# Altium project PCB_Project.PrjPcb
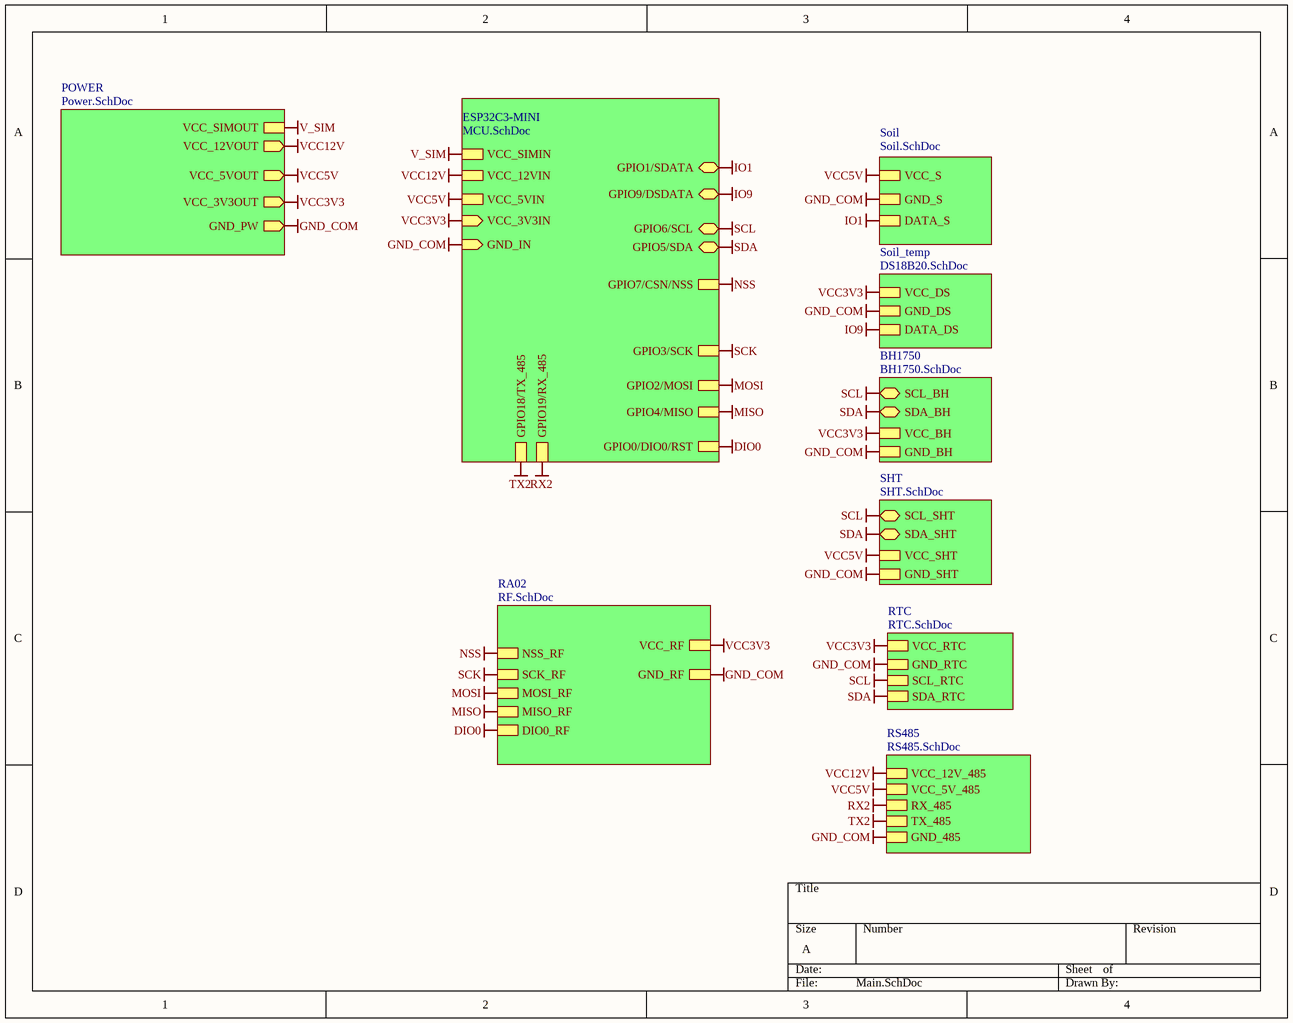
[diagram p0: Main.SchDoc]
7 sheets, 55 parts. Net scope: hierarchical (ports join the sheet entries above them; power ports are global).
Board file: Node_ver2.PcbDoc
Sheets:
  Main.SchDoc
    ESP32C3-MINI = MCU.SchDoc
    POWER = Power.SchDoc
    RTC = RTC.SchDoc
    Soil = Soil.SchDoc
    Soil_temp = DS18B20.SchDoc
    RA02 = RF.SchDoc

## Sheet Main.SchDoc
size A

### Sub-sheets
BH1750 = BH1750.SchDoc (file not in this document): SCL_BH (bidir), SDA_BH (bidir), VCC_BH, GND_BH
ESP32C3-MINI = MCU.SchDoc: VCC_3V3IN (in), GND_IN (in), GPIO1/SDATA (bidir), GPIO9/DSDATA (bidir), GPIO6/SCL (bidir), GPIO5/SDA (bidir), VCC_5VIN, VCC_12VIN, GPIO18/TX_485, GPIO19/RX_485, VCC_SIMIN, GPIO0/DIO0/RST, GPIO2/MOSI, GPIO3/SCK, GPIO7/CSN/NSS, GPIO4/MISO
POWER = Power.SchDoc: VCC_12VOUT (out), VCC_5VOUT (out), VCC_3V3OUT (out), GND_PW (out), VCC_SIMOUT
RA02 = RF.SchDoc: NSS_RF, SCK_RF, MOSI_RF, MISO_RF, DIO0_RF, VCC_RF, GND_RF
RS485 = RS485.SchDoc (file not in this document): VCC_12V_485, VCC_5V_485, RX_485, TX_485, GND_485
RTC = RTC.SchDoc: VCC_RTC, GND_RTC, SCL_RTC, SDA_RTC
SHT = SHT.SchDoc (file not in this document): SCL_SHT (bidir), SDA_SHT (bidir), VCC_SHT, GND_SHT
Soil = Soil.SchDoc: VCC_S, GND_S, DATA_S
Soil_temp = DS18B20.SchDoc: VCC_DS, GND_DS, DATA_DS

### Nets
DIO0: sheet ESP32C3-MINI/GPIO0/DIO0/RST, sheet RA02/DIO0_RF  [project net GPIO0]
GND_COM: sheet ESP32C3-MINI/GND_IN, sheet POWER/GND_PW, sheet RTC/GND_RTC, sheet Soil/GND_S, sheet Soil_temp/GND_DS, sheet BH1750/GND_BH, sheet SHT/GND_SHT, sheet RS485/GND_485, sheet RA02/GND_RF  [project net GND]
IO1: sheet ESP32C3-MINI/GPIO1/SDATA, sheet Soil/DATA_S  [project net GPIO1]
IO9: sheet ESP32C3-MINI/GPIO9/DSDATA, sheet Soil_temp/DATA_DS  [project net GPIO10]
MISO: sheet ESP32C3-MINI/GPIO4/MISO, sheet RA02/MISO_RF  [project net GPIO4]
MOSI: sheet ESP32C3-MINI/GPIO19/RX_485, sheet ESP32C3-MINI/GPIO2/MOSI, sheet RS485/RX_485, sheet RA02/MOSI_RF  [also labelled RX2]  [project net GPIO18]
NSS: sheet ESP32C3-MINI/GPIO7/CSN/NSS, sheet RA02/NSS_RF  [project net GPIO7]
SCK: sheet ESP32C3-MINI/GPIO3/SCK, sheet RA02/SCK_RF  [project net GPIO3]
SCL: sheet ESP32C3-MINI/GPIO6/SCL, sheet RTC/SCL_RTC, sheet BH1750/SCL_BH, sheet SHT/SCL_SHT  [project net GPIO6]
SDA: sheet ESP32C3-MINI/GPIO5/SDA, sheet RTC/SDA_RTC, sheet BH1750/SDA_BH, sheet SHT/SDA_SHT  [project net GPIO5]
TX2: sheet ESP32C3-MINI/GPIO18/TX_485, sheet RS485/TX_485  [project net GPIO19]
V_SIM: sheet ESP32C3-MINI/VCC_SIMIN, sheet POWER/VCC_SIMOUT  [project net V_SIM_7V]
VCC3V3: sheet ESP32C3-MINI/VCC_3V3IN, sheet POWER/VCC_3V3OUT, sheet RTC/VCC_RTC, sheet Soil_temp/VCC_DS, sheet BH1750/VCC_BH, sheet RA02/VCC_RF  [project net VCC_3V3MCU]
VCC5V: sheet ESP32C3-MINI/VCC_5VIN, sheet POWER/VCC_5VOUT, sheet Soil/VCC_S, sheet SHT/VCC_SHT, sheet RS485/VCC_5V_485  [project net VCC_5VPW]
VCC12V: sheet ESP32C3-MINI/VCC_12VIN, sheet POWER/VCC_12VOUT, sheet RS485/VCC_12V_485  [project net BAT_11V6]

## Sheet MCU.SchDoc
size A
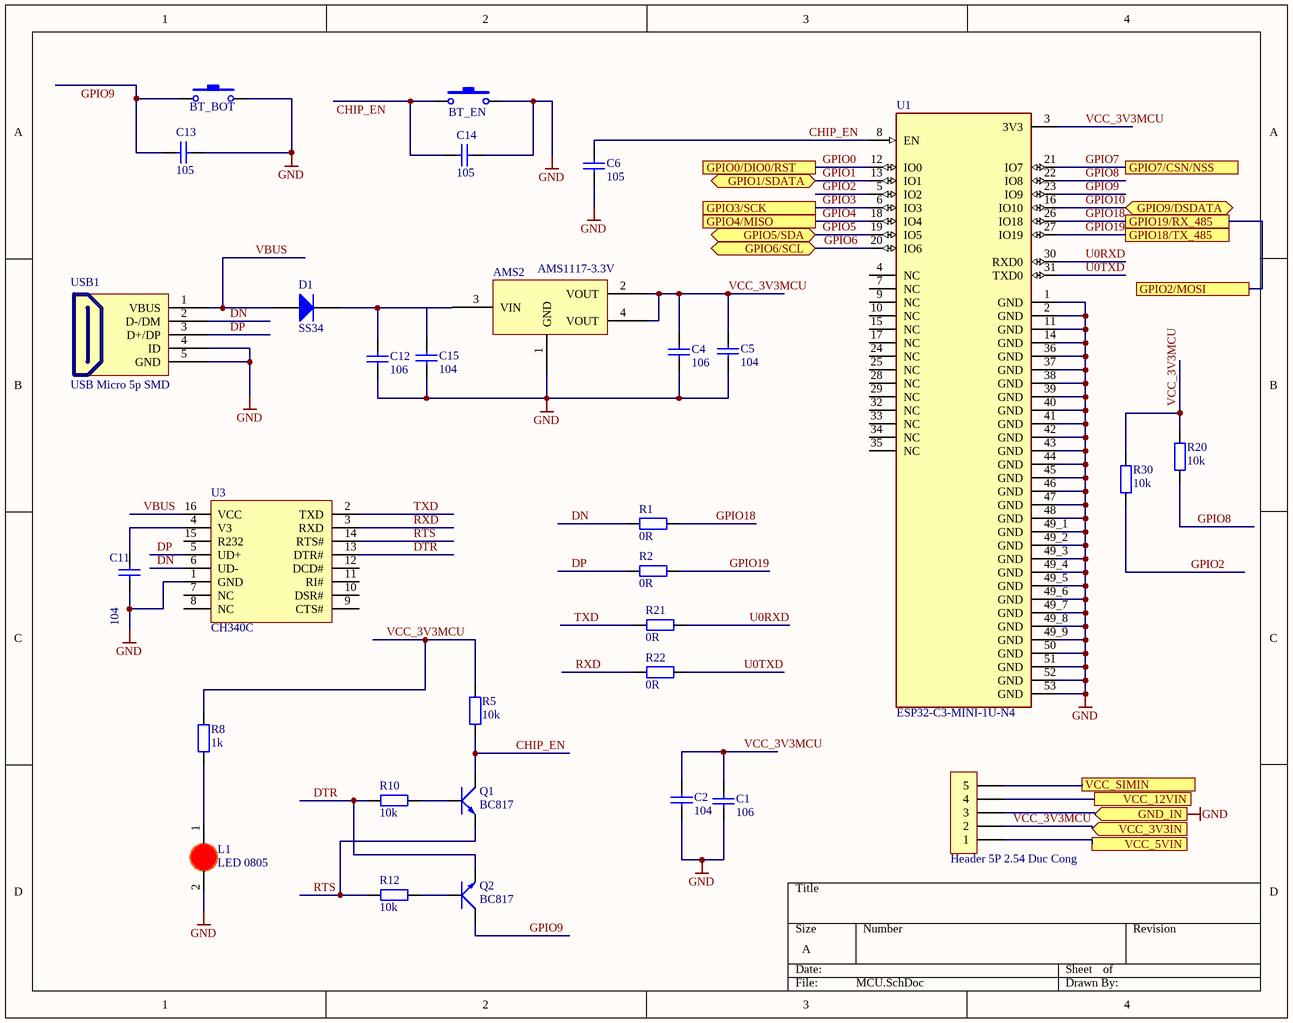
[diagram p1: MCU.SchDoc]

### Parts
AMS2  AMS1117-3.3V  [SOT223]
BT_BOT  Nut Nhan 2 Chan SMD 3x6x2.5  [Nut Nhan 2 Chan SMD 3x6x2.5]  (value not drawn)
BT_EN  Nut Nhan 2 Chan SMD 3x6x2.5  [Nut Nhan 2 Chan SMD 3x6x2.5]  (value not drawn)
C1  106  [tu 0805]
C2  104  [tu 0805]
C4  106  [tu 0805]
C5  104  [tu 0805]
C6  105  [tu 0805]
C11  104  [tu 0805]
C12  106  [tu 0805]
C13  105  [tu 0805]
C14  105  [tu 0805]
C15  104  [tu 0805]
D1  SS34  [DIODE SMA]
L1  LED 0805  [LED-0805-Red]
P_IN  Header 5P 2.54 Duc Cong  [Header 5P DC 2.54]
Q1  BC817  [SOT-23]
Q2  BC817  [SOT-23]
R1  0R  [tro smd 0805]
R2  0R  [tro smd 0805]
R5  10k  [tro smd 0805]
R8  1k  [tro smd 0805]
R10  10k  [tro smd 0805]
R12  10k  [tro smd 0805]
R20  10k  [tro smd 0805]
R21  0R  [tro smd 0805]
R22  0R  [tro smd 0805]
R30  10k  [tro smd 0805]
U1  ESP32-C3-MINI-1U-N4  [XCVR_ESP32-C3-MINI-1U-N4]
U3  CH340C  [SOIC16_50_284_25X90_SMT]
USB1  USB Micro 5p SMD  [USB Micro 5p SMD]

### Ports
GND_IN (in), GPIO0/DIO0/RST, GPIO1/SDATA (bidir), GPIO2/MOSI, GPIO3/SCK, GPIO4/MISO, GPIO5/SDA (bidir), GPIO6/SCL (bidir), GPIO7/CSN/NSS, GPIO9/DSDATA (bidir), GPIO18/TX_485, GPIO19/RX_485, VCC_3V3IN (in), VCC_5VIN, VCC_12VIN, VCC_SIMIN

### Nets
BAT_11V6: P_IN.4 ; port VCC_12VIN
GND: AMS2.1(GND) BT_BOT.2 BT_EN.2 C1.2 C2.2 C4.2 C5.2 C6.2 C11.2 C12.2 C13.1 C14.1 C15.2 L1.2(K) P_IN.3 U1.1(GND) U1.2(GND) U1.11(GND) U1.14(GND) U1.36(GND) U1.37(GND) U1.38(GND) U1.39(GND) U1.40(GND) U1.41(GND) U1.42(GND) U1.43(GND) U1.44(GND) U1.45(GND) U1.46(GND) U1.47(GND) U1.48(GND) U1.49_1(GND) U1.49_2(GND) U1.49_3(GND) U1.49_4(GND) U1.49_5(GND) U1.49_6(GND) U1.49_7(GND) U1.49_8(GND) U1.49_9(GND) U1.50(GND) U1.51(GND) U1.52(GND) U1.53(GND) U3.1(GND) USB1.4(ID) USB1.5(GND) ; port GND_IN
GPIO0: U1.12(IO0) ; port GPIO0/DIO0/RST
GPIO1: U1.13(IO1) ; port GPIO1/SDATA
GPIO3: U1.6(IO3) ; port GPIO3/SCK
GPIO4: U1.18(IO4) ; port GPIO4/MISO
GPIO5: U1.19(IO5) ; port GPIO5/SDA
GPIO6: U1.20(IO6) ; port GPIO6/SCL
GPIO7: U1.21(IO7) ; port GPIO7/CSN/NSS
GPIO10: U1.16(IO10) ; port GPIO9/DSDATA
GPIO18: R1.2 U1.26(IO18) ; port GPIO2/MOSI, port GPIO19/RX_485
GPIO19: R2.2 U1.27(IO19) ; port GPIO18/TX_485
V_SIM_7V: P_IN.5 ; port VCC_SIMIN
VCC_3V3MCU: AMS2.2(VOUT) AMS2.4(VOUT) C1.1 C2.1 C4.1 C5.1 P_IN.2 R5.2 R8.2 R20.2 R30.2 U1.3(3V3) ; port VCC_3V3IN
VCC_5VPW: P_IN.1 ; port VCC_5VIN
CHIP_EN: BT_EN.1 C6.1 C14.2 Q1.3(C) R5.1 U1.8(EN)
DN: R1.1 U3.6(UD-) USB1.2(D-/DM)
DP: R2.1 U3.5(UD+) USB1.3(D+/DP)
DTR: Q2.2(E) R10.1 U3.13(DTR#)
GPIO2: R30.1 U1.5(IO2)
GPIO8: R20.1 U1.22(IO8)
GPIO9: BT_BOT.1 C13.2 Q2.3(C) U1.23(IO9)
RTS: Q1.2(E) R12.1 U3.14(RTS#)
RXD: R22.1 U3.3(RXD)
TXD: R21.1 U3.2(TXD)
U0RXD: R21.2 U1.30(RXD0)
U0TXD: R22.2 U1.31(TXD0)
VBUS: D1.1(A) U3.16(VCC) USB1.1(VBUS)
NetAMS2_3: AMS2.3(VIN) C12.1 D1.2(K)
NetC11_1: C11.1 U3.4(V3)
NetL1_1: L1.1(A) R8.1
NetQ1_1: Q1.1(B) R10.2
NetQ2_1: Q2.1(B) R12.2

Not connected (* = marked no-connect by the designer): C15 1; U1 4(NC) 7(NC) 9(NC) 10(NC) 15(NC) 17(NC) 24(NC) 25(NC) 28(NC) 29(NC) 32(NC) 33(NC) 34(NC) 35(NC); U3 7(NC) 8(NC) 9(CTS#) 10(DSR#) 11(RI#) 12(DCD#) 15(R232)

### Library data of the parts
AMS2 = AMS1117 SMD: Dán; Value: AMS1117-3.3V SOT223; Don_Vi: Con; Ma_Hang: MH000596; Ghi_Chu: *; Kieu_Chan: *; Chung_Loai: Dán
BT_BOT BT_EN = Nut Nhan 2 Chan SMD 3x6x2.5: Ten: Nút Nhấn 2 Chân 3x6x2.5MM SMD; Ma_Hang: MH001036
C1 = Tu 0805 106 16V 10%: Dán; Don_Vi: Con; So_Chan: 2; Ten_Linh_Kien: Tụ 0805 106-10uF 10% 16V; Ma_Hang: MH004553; Chung_Loai: Dán; Kieu_Chan: *
C2 C5 C11 C15 = Tu 0805 104 50V 10%: Dán; Don_Vi: Con; So_Chan: 2; Ten_Linh_Kien: Tụ 0805 104-100nF 10% 50V; Ma_Hang: MH004551; Chung_Loai: Dán; Kieu_Chan: *
C4 C12 = Tu 0805 106 16V 10%: Dán; Ten_Linh_Kien: Tụ 0805 106-10uF 10% 16V; So_Chan: 2; Don_Vi: Con; Ma_Hang: MH004553; Chung_Loai: Dán; Kieu_Chan: *
C6 C13 C14 = Tu 0805 105 50V 10%: Dán; Don_Vi: Con; So_Chan: 2; Ten_Linh_Kien: Tụ 0805 105-1uF 10% 50V; Ma_Hang: MH004552; Chung_Loai: Dán; Kieu_Chan: *
D1 = Diode SS34 ( 1N5822 ): Dán; Don_Vi: Con; Ma_Hang: MH002104; Ten_Linh_Kien: Diode SS34 3A 40V SMA ( 1N5822 SS34A); Kieu_Chan: *; Chung_Loai: Dán
L1 = LED 0805 Do: Dán; Don_Vi: Con; Ma_Hang: MH000897; Ten_Linh_Kien: LED 0805 Màu Đỏ (Red); Ghi_Chu: *; Kieu_Chan: *; Chung_Loai: Dán
P_IN = Header 5P 2.54 Duc Cong: Cắm; Ten_Linh_Kien: Header 5P XH2.54-5P Đực Cong; Don_Vi: Con; Ma_Hang: MH001308; Chung_Loai: Cắm
Q1 Q2 = Trans BC817: SOT-23 - C8658; Value: C9014
R1 R2 R21 R22 = Tro 0805 5% 0R: Dán; Don_Vi: Con; So_Chan: 2; Ten_Linh_Kien: Trở 0805 5% 0R; Ma_Hang: MH005230; Chung_Loai: Dán; Kieu_Chan: *
R5 R10 R12 R20 R30 = Tro 0805 1% 10k: Dán; Don_Vi: Con; So_Chan: 2; Ten_Linh_Kien: Trở 0805 1% 10k; Ma_Hang: MH005473; Chung_Loai: Dán; Kieu_Chan: *
R8 = Tro 0805 1% 1k: Dán; Don_Vi: Con; So_Chan: 2; Ten_Linh_Kien: Trở 0805 1% 1k; Ma_Hang: MH005468; Chung_Loai: Dán; Kieu_Chan: *
U1 = ESP32-C3-MINI-1U-N4: Bluetooth, WiFi 802.11b/g/n, Bluetooth v5.0 Transceiver Module 2.412GHz ~ 2.484GHz Antenna Not Included, I-PEX Surface Mount; MF: Espressif Systems; Value: *; SnapEDA_Link: https://www.snapeda.com/parts/ESP32-C3-MINI-1U-N4/Espressif+Systems/view-part/?ref=snap; MP: ESP32-C3-MINI-1U-N4; Purchase-URL: https://pricing.snapeda.com/search/part/ESP32-C3-MINI-1U-N4/?ref=eda; Check_prices: https://www.snapeda.com/parts/ESP32-C3-MINI-1U-N4/Espressif+Systems/view-part/?ref=eda; Availability: In Stock; Price: None; Package: None
U3 = IC_CH340C: USB Bridge, USB to UART USB 2.0 UART Interface; Manufacturer: Olimex; Alternate Part Number-1: NA; Manufacturer Part Number: CH340C; Case/Package: SOIC16; Supplier-1: LCSC; Supplier Part Number-1: C84681
USB1 = USB Micro 5p SMD: USB Type B; Ten: MicroUSB MK5P SMD; Ma_Hang: MH001020

## Sheet Power.SchDoc
size A
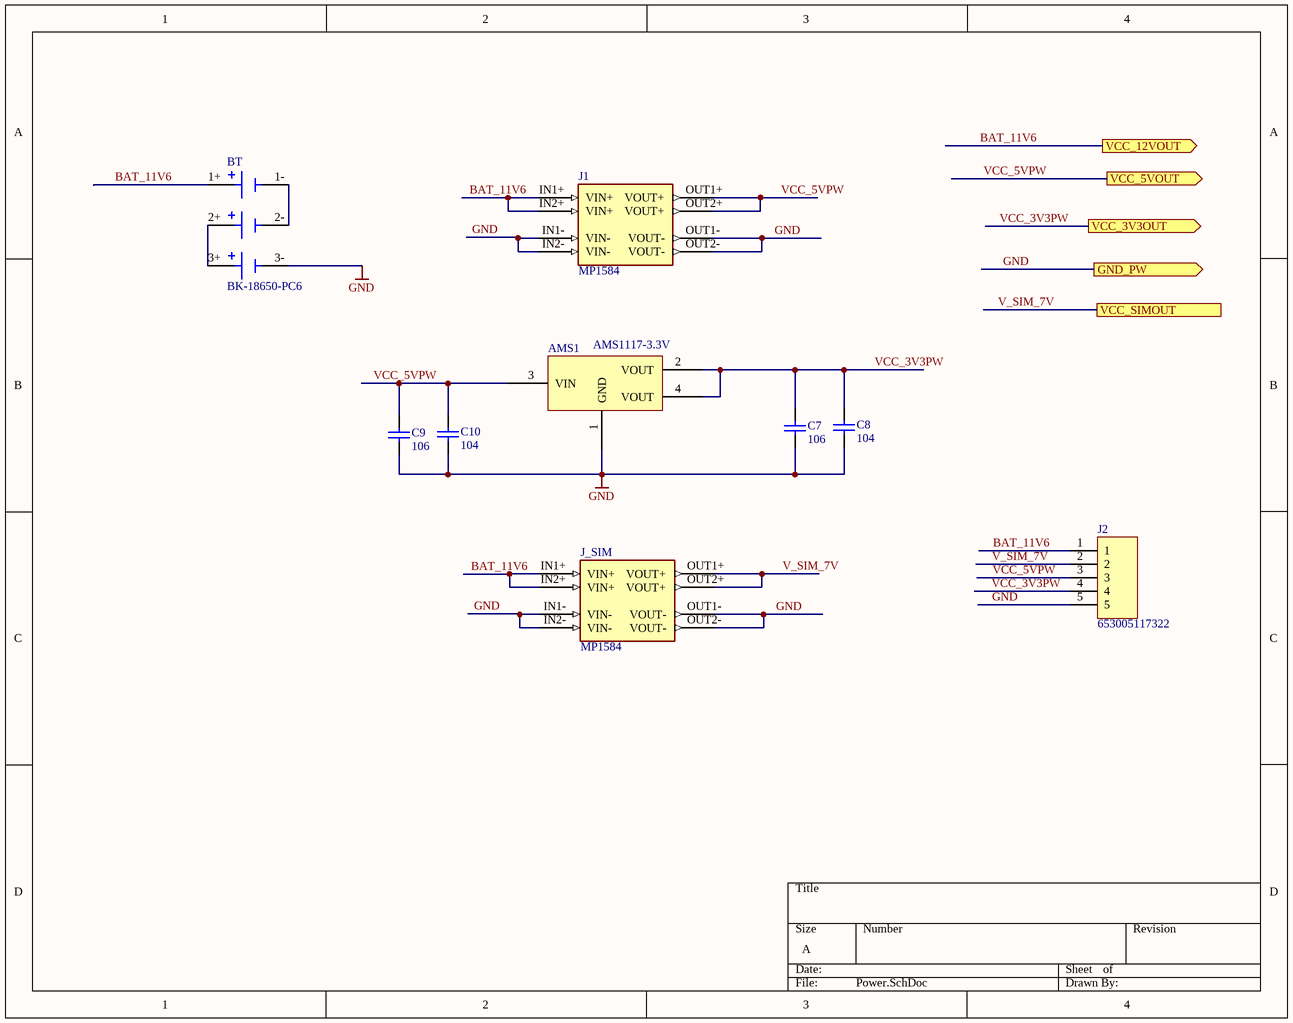
[diagram p2: Power.SchDoc]

### Parts
AMS1  AMS1117-3.3V  [SOT223]
BT  BK-18650-PC6  [BAT_BK-18650-PC6]
C7  106  [tu 0805]
C8  104  [tu 0805]
C9  106  [tu 0805]
C10  104  [tu 0805]
J1  MP1584  [DC-BRICK]
J2  653005117322  [CON5_50_653005117322_TH_RA]
J_SIM  MP1584  [DC-BRICK]

### Ports
GND_PW (out), VCC_3V3OUT (out), VCC_5VOUT (out), VCC_12VOUT (out), VCC_SIMOUT

### Nets
BAT_11V6: BT.1+ J1.IN1+(VIN+) J1.IN2+(VIN+) J2.1 J_SIM.IN1+(VIN+) J_SIM.IN2+(VIN+) ; port VCC_12VOUT
GND: AMS1.1(GND) BT.3- C7.2 C8.2 C9.2 C10.2 J1.IN1-(VIN-) J1.IN2-(VIN-) J1.OUT1-(VOUT-) J1.OUT2-(VOUT-) J2.5 J_SIM.IN1-(VIN-) J_SIM.IN2-(VIN-) J_SIM.OUT1-(VOUT-) J_SIM.OUT2-(VOUT-) ; port GND_PW
V_SIM_7V: J2.2 J_SIM.OUT1+(VOUT+) J_SIM.OUT2+(VOUT+) ; port VCC_SIMOUT
VCC_3V3PW: AMS1.2(VOUT) AMS1.4(VOUT) C7.1 C8.1 J2.4 ; port VCC_3V3OUT  [project net VCC_3V3MCU]
VCC_5VPW: AMS1.3(VIN) C9.1 C10.1 J1.OUT1+(VOUT+) J1.OUT2+(VOUT+) J2.3 ; port VCC_5VOUT
NetBT_1-: BT.1- BT.2-
NetBT_2+: BT.2+ BT.3+

### Library data of the parts
AMS1 = AMS1117 SMD: as AMS2 on sheet MCU; Ghi_Chu: *; Kieu_Chan: *; Chung_Loai: Dán
BT = BK-18650-PC6: Battery Holder _Open_ 18650 3 Cell PC Pin; MF: MPD; Price: None; Package: None; Availability: Unavailable; SnapEDA_Link: https://www.snapeda.com/parts/BK-18650-PC6/MPD/view-part/4480464/?ref=snap; Value: *; MP: BK-18650-PC6
C7 C9 = Tu 0805 106 16V 10%: as C4 on sheet MCU; Chung_Loai: Dán; Kieu_Chan: *
C8 C10 = Tu 0805 104 50V 10%: as C2 on sheet MCU; Chung_Loai: Dán; Kieu_Chan: *
J1 J_SIM = MP1584: Buck Switching Regulator IC Positive Adjustable 0.8V 1 Output 3A 8-SOIC (0.154, 3.90mm Width) Exposed Pad; MF: Monolithic Power; SnapEDA_Link: https://www.snapeda.com/parts/MP1584/Monolithic+Power+Systems+Inc./view-part/?ref=snap; Package: SOIC-8 Monolithic Power; Value: *; MP: MP1584; Check_prices: https://www.snapeda.com/parts/MP1584/Monolithic+Power+Systems+Inc./view-part/?ref=eda
J2 = CON-PLG_5X1-50-RA-TH: 5 Pins, 1 Row 1.25mm Pitch, right angle Connector, male; Manufacturer: JST; Mating Part Number: 653005113322; Crimp Part Number: 653153128130; Alternate Part Number-1: NA; Manufacturer Part Number: 653005117322; Case/Package: TH-CON; Supplier-1: WURTH; Supplier Part Number-1: 653005117322

## Sheet RTC.SchDoc
size A
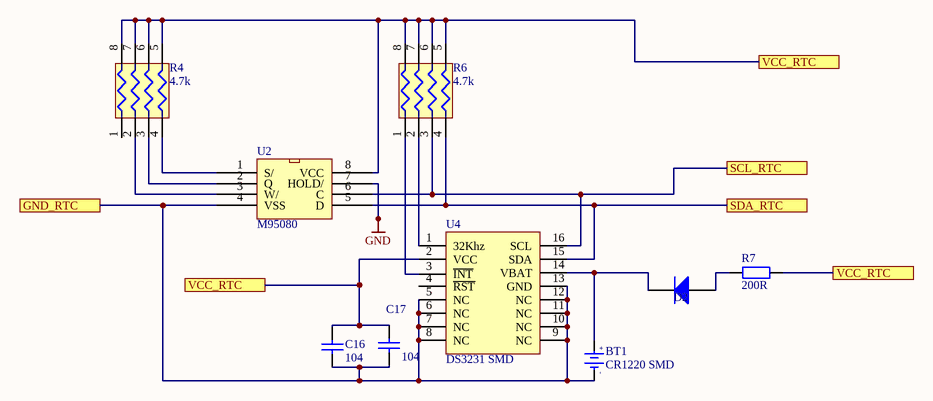
[diagram p3: RTC.SchDoc]

### Parts
BT1  CR1220 SMD  [DE PIN CR1220]
C16  104  [tu 0805]
C17  104  [tu 0805]
D2  SS34  [DIODE SMA]  (value not drawn)
R4  4.7k  [tro bang 0603 4]
R6  4.7k  [tro bang 0603 4]
R7  200R  [tro smd 0805]
U2  M95080  [SOP8_L]
U4  DS3231 SMD  [SOIC 16]

### Ports
GND_RTC, SCL_RTC, SDA_RTC, VCC_RTC

### Nets
GND: BT1.2(GND) C16.2 C17.2 U2.4(VSS) U2.7(HOLD/) U4.5(NC) U4.6(NC) U4.7(NC) U4.8(NC) U4.9(NC) U4.10(NC) U4.11(NC) U4.12(NC) U4.13(GND) ; port GND_RTC
GPIO5: R6.4 U2.5(D) U4.15(SDA) ; port SDA_RTC
GPIO6: R6.3 U2.6(C) U4.16(SCL) ; port SCL_RTC
VCC_3V3MCU: C16.1 C17.1 R4.5 R4.6 R4.7 R4.8 R6.5 R6.6 R6.7 R6.8 R7.2 U2.8(VCC) U4.2(VCC) ; port VCC_RTC
NetBT1_1: BT1.1(+3V) D2.2(K) U4.14(VBAT)
NetD2_1: D2.1(A) R7.1
NetR4_2: R4.2 U2.3(W/)
NetR4_3: R4.3 U2.2(Q)
NetR4_4: R4.4 U2.1(S/)
NetR6_1: R6.1 U4.3(~{INT})
NetR6_2: R6.2 U4.1(32Khz)

Not connected (* = marked no-connect by the designer): R4 1; U4 4(~{RST})

### Notes on the sheet
- (in symbol De pin CR1220 SMD) +; -

### Library data of the parts
BT1 = De pin CR1220 SMD: Ten: Đế PIN CR1220 SMD; Ma_Hang: MH000833
C16 C17 = Tu 0805 104 50V 10%: as C2 on sheet MCU; Chung_Loai: Dán; Kieu_Chan: *
D2 = Diode SS34 ( 1N5822 ): as D1 on sheet MCU; Kieu_Chan: *; Chung_Loai: Dán
R4 R6 = Tro bang 0603 4.7k: Dán; Don_Vi: Con; So_Chan: 8; Ten_Linh_Kien: Trở băng 0603x4 4.7k; Ma_Hang: MH001448; Chung_Loai: Dán; Kieu_Chan: *
R7 = Tro 0805 5% 220R: Dán; Don_Vi: Con; So_Chan: 2; Ten_Linh_Kien: Trở 0805 5% 220R; Ma_Hang: MH005259; Chung_Loai: Dán; Kieu_Chan: *
U2 = EEPROM_M95080
U4 = DS3231 SMD: SOIC

## Sheet Soil.SchDoc
size A
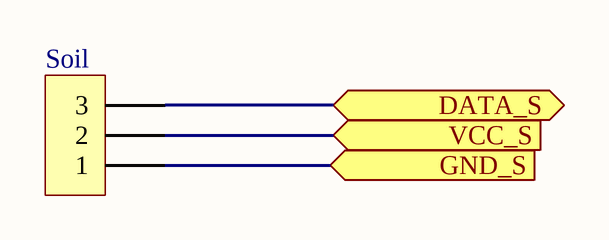
[diagram p4: Soil.SchDoc]

### Parts
Soil  Header 3P 2.54 Duc Thang  [XH2.54M-3]  (value not drawn)

### Ports
DATA_S (bidir), GND_S (in), VCC_S (in)

### Nets
GND: Soil.1 ; port GND_S
GPIO1: Soil.3 ; port DATA_S
VCC_5VPW: Soil.2 ; port VCC_S

### Library data of the parts
Soil = Header 3P 2.54 Duc Thang: Cắm; Ten_Linh_Kien: Header 3P XH2.54-3P Đực Thẳng; Don_Vi: Con; Ma_Hang: MH001292; Chung_Loai: Cắm

## Sheet DS18B20.SchDoc
size A
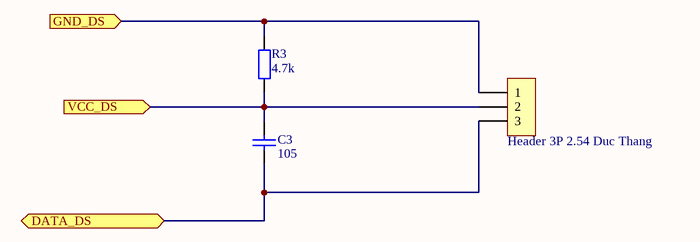
[diagram p5: DS18B20.SchDoc]

### Parts
C3  105  [tu 0805]
DS18  Header 3P 2.54 Duc Thang  [XH2.54M-3]
R3  4.7k  [tro smd 0805]

### Ports
DATA_DS (bidir), GND_DS (in), VCC_DS (in)

### Nets
GND: DS18.1 R3.2 ; port GND_DS
GPIO10: C3.2 DS18.3 ; port DATA_DS
VCC_3V3MCU: C3.1 DS18.2 R3.1 ; port VCC_DS

### Library data of the parts
C3 = Tu 0805 105 50V 10%: as C6 on sheet MCU; Chung_Loai: Dán; Kieu_Chan: *
DS18 = Header 3P 2.54 Duc Thang: as Soil on sheet Soil; Chung_Loai: Cắm
R3 = Tro 0805 5% 4.7k: Dán; Don_Vi: Con; So_Chan: 2; Ten_Linh_Kien: Trở 0805 5% 4.7k; Ma_Hang: MH005307; Chung_Loai: Dán; Kieu_Chan: *

## Sheet RF.SchDoc
size A
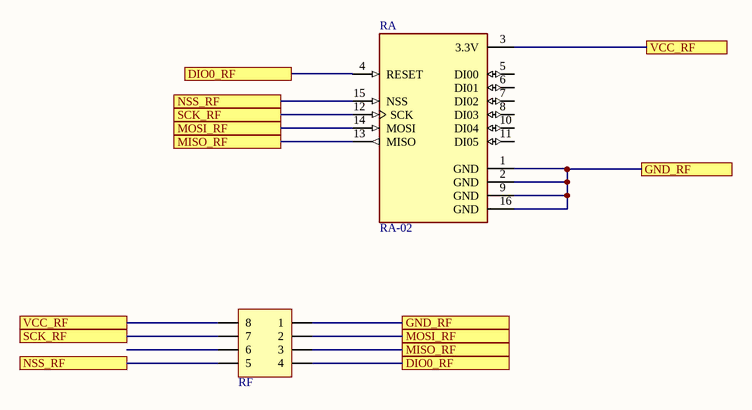
[diagram p6: RF.SchDoc]

### Parts
RA  RA-02  [RA-02]
RF  JP 2x4 2.54  [JP 2x4 DT]  (value not drawn)

### Ports
DIO0_RF, GND_RF, MISO_RF, MOSI_RF, NSS_RF, SCK_RF, VCC_RF

### Nets
GND: RA.1(GND) RA.2(GND) RA.9(GND) RA.16(GND) RF.1 ; port GND_RF
GPIO0: RA.4(RESET) RF.4 ; port DIO0_RF
GPIO3: RA.12(SCK) RF.7 ; port SCK_RF
GPIO4: RA.13(MISO) RF.3 ; port MISO_RF
GPIO7: RA.15(NSS) RF.5 ; port NSS_RF
GPIO18: RA.14(MOSI) RF.2 ; port MOSI_RF
VCC_3V3MCU: RA.3(3.3V) RF.8 ; port VCC_RF

Not connected (* = marked no-connect by the designer): RA 5(DI00) 6(DI01) 7(DI02) 8(DI03) 10(DI04) 11(DI05); RF 6

### Library data of the parts
RA = RA-02: General ISM < 1GHz LoRaâ„¢ Transceiver Module 410MHz ~ 525MHz Antenna Not Included, I-PEX Surface Mount; MF: Ai-Thinker; Package: None; Price: None; Value: *; SnapEDA_Link: https://www.snapeda.com/parts/RA-02/AI-Thinker/view-part/?ref=snap; MP: RA-02; Availability: Not in stock; Check_prices: https://www.snapeda.com/parts/RA-02/AI-Thinker/view-part/?ref=eda
RF = JP 2x4 2.54 Duc Thang: Cắm; Ten_Linh_Kien: Jump Đôi Đực 2.54MM 2x40P Thẳng 11MM; Don_Vi: Con; Ma_Hang: MH002686; Ghi_Chu: *; Kieu_Chan: *; Chung_Loai: Cắm

## Nets that join several sheets
BAT_11V6: MCU (P_IN.4), Power (6 pins)
GND: MCU (48 pins), Power (15 pins), RTC (14 pins), Soil (Soil.1), DS18B20 (DS18.1 R3.2), RF (5 pins)
GPIO0: MCU (U1.12), RF (RA.4 RF.4)
GPIO1: MCU (U1.13), Soil (Soil.3)
GPIO3: MCU (U1.6), RF (RA.12 RF.7)
GPIO4: MCU (U1.18), RF (RA.13 RF.3)
GPIO5: MCU (U1.19), RTC (R6.4 U2.5 U4.15)
GPIO6: MCU (U1.20), RTC (R6.3 U2.6 U4.16)
GPIO7: MCU (U1.21), RF (RA.15 RF.5)
GPIO10: MCU (U1.16), DS18B20 (C3.2 DS18.3)
GPIO18: MCU (R1.2 U1.26), RF (RA.14 RF.2)
V_SIM_7V: MCU (P_IN.5), Power (J2.2 J_SIM.OUT1+ J_SIM.OUT2+)
VCC_3V3MCU: MCU (12 pins), Power (5 pins), RTC (13 pins), DS18B20 (C3.1 DS18.2 R3.1), RF (RA.3 RF.8)
VCC_5VPW: MCU (P_IN.1), Power (6 pins), Soil (Soil.2)